# EAGLE design DMX RX (EAGLE 6.6.0)
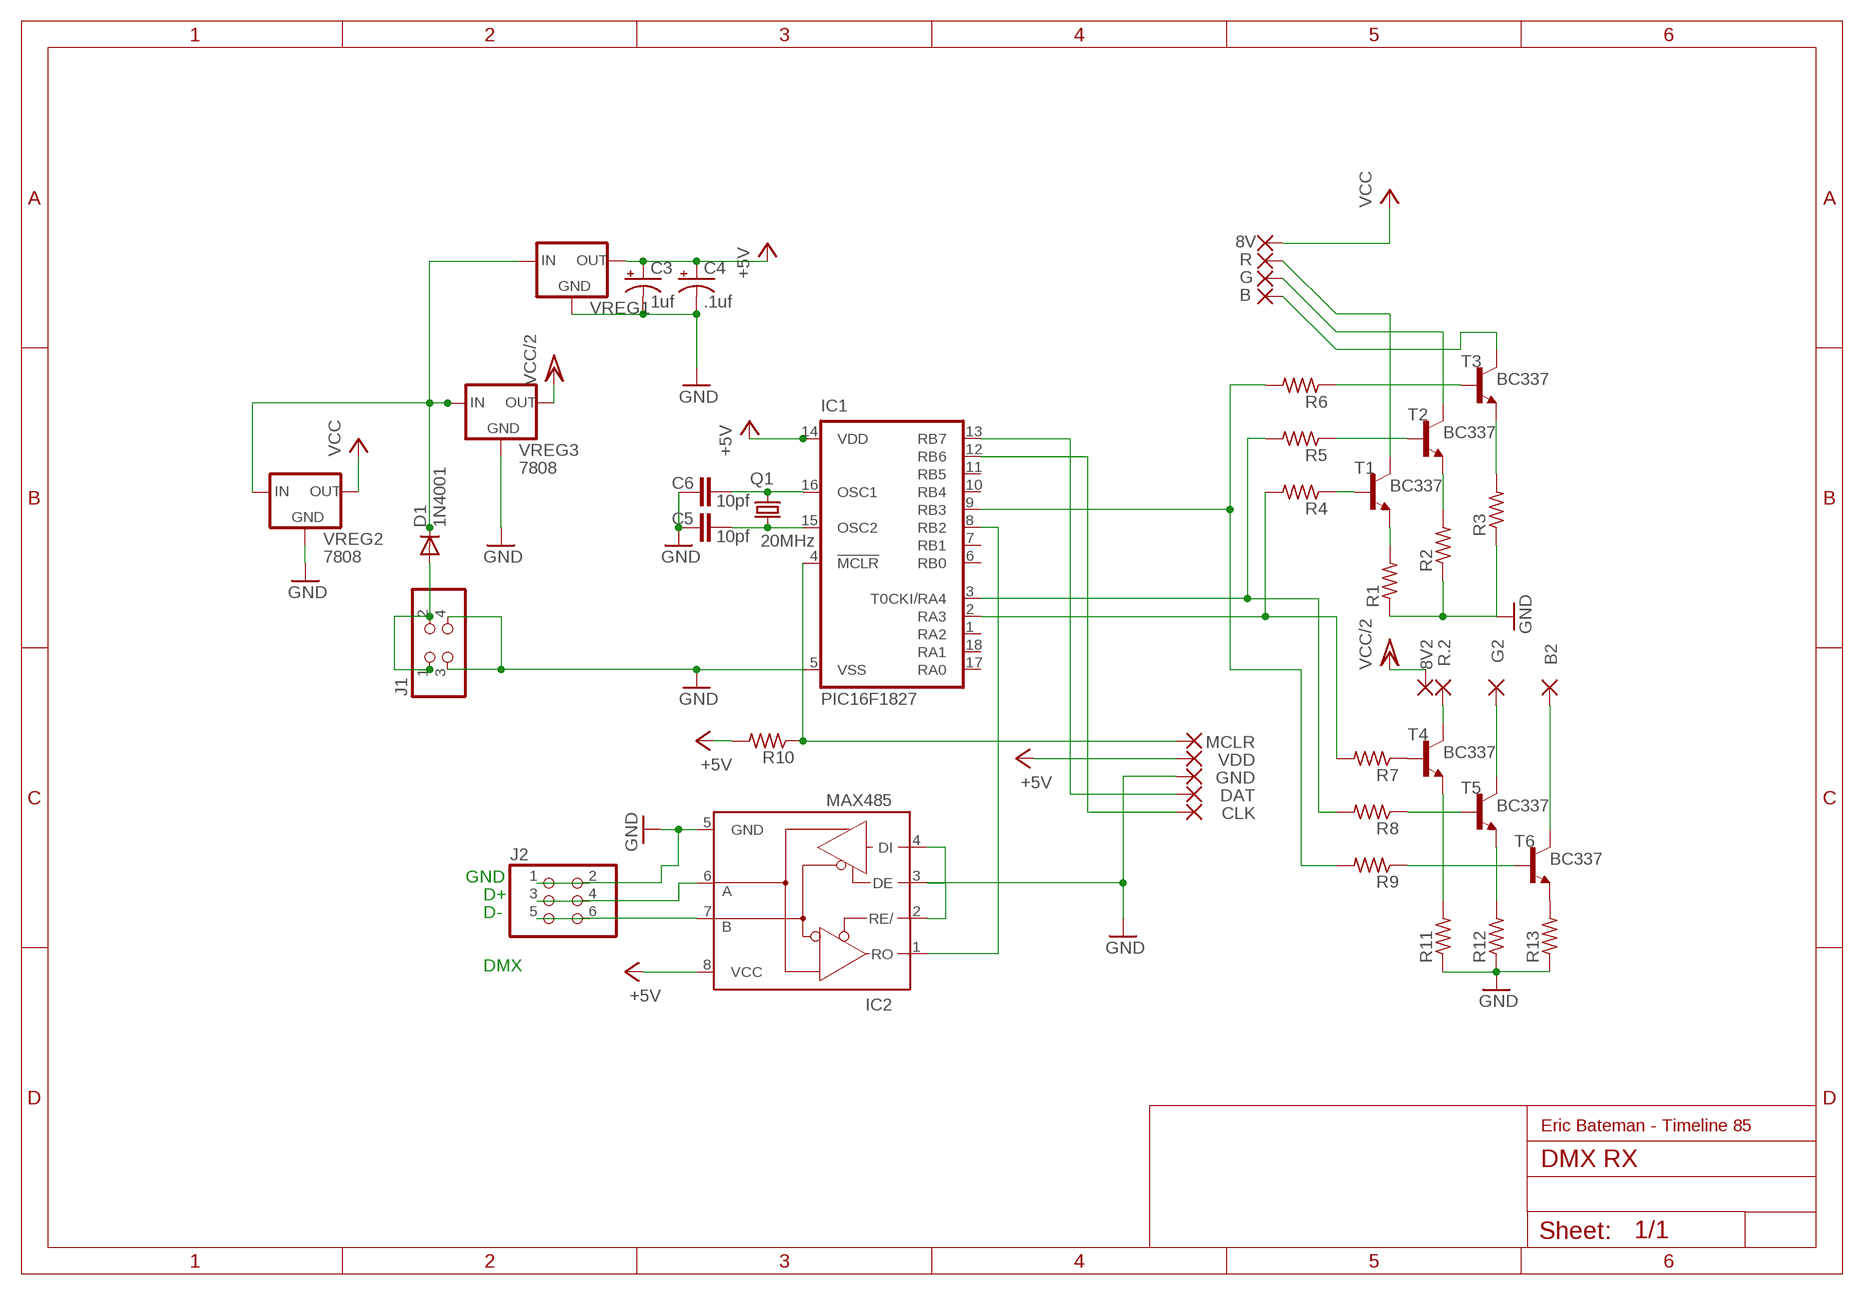
[diagram p0: schematic, sheet 1]

## Parts
8V  2,15/1,0  [2,15/1,0]
8V2  2,15/1,0  [2,15/1,0]
B  2,15/1,0  [2,15/1,0]
B2  2,15/1,0  [2,15/1,0]
C3  1uf  CPOL-USE2.5-7  [E2,5-7]
C4  .1uf  CPOL-USE2.5-7  [E2,5-7]
C5  10pf  C5/3.5  [C5B3.5]
C6  10pf  C5/3.5  [C5B3.5]
CLK  1,6/0,8  [1,6/0,8]
D1  1N4001  DIODEPTH  [DIODE-1N4001]
DAT  1,6/0,8  [1,6/0,8]
G  2,15/1,0  [2,15/1,0]
G2  2,15/1,0  [2,15/1,0]
GND  1,6/0,8  [1,6/0,8]
IC1  PIC16F1827  PIC16F83P  [DIL18]
IC2  MAX485  MAX3468CPA  [DIL08]
J1  PINHD-2X2/90  [2X02/90]
J2  PINHD-2X3/90  [2X03/90]
MCLR  1,6/0,8  [1,6/0,8]
Q1  20MHz  CRYSTALHC49S  [HC49/S]
R  2,15/1,0  [2,15/1,0]
R1  R-US_0411/12  [0411/12]
R2  R-US_0411/12  [0411/12]
R3  R-US_0411/12  [0411/12]
R4  R-US_0204/7  [0204/7]
R5  R-US_0204/7  [0204/7]
R6  R-US_0204/7  [0204/7]
R7  R-US_0204/7  [0204/7]
R8  R-US_0204/7  [0204/7]
R9  R-US_0204/7  [0204/7]
R10  R-US_0204/7  [0204/7]
R11  R-US_0411/12  [0411/12]
R12  R-US_0411/12  [0411/12]
R13  R-US_0411/12  [0411/12]
R.2  2,15/1,0  [2,15/1,0]
T1  BC337  [TO92]
T2  BC337  [TO92]
T3  BC337  [TO92]
T4  BC337  [TO92]
T5  BC337  [TO92]
T6  BC337  [TO92]
VDD  1,6/0,8  [1,6/0,8]
VREG1  78LXX  [78LXX]
VREG2  7808  78XXS  [78XXS]
VREG3  7808  78XXS  [78XXS]

## Nets
+5V: C3.+ C4.+ IC1.14(VDD) IC2.8(VCC) R10.2 VDD.1(P) VREG1.OUT
+12V: D1.C VREG1.IN VREG2.IN VREG3.IN
A: IC2.6(A) J2.3 J2.4
B: IC2.7(B) J2.5 J2.6
CLK: CLK.1(P) IC1.12(RB6)
DAT: DAT.1(P) IC1.13(RB7)
DC-IN: D1.A J1.1 J1.2
GND: C3.- C4.- C5.2 C6.2 GND.1(P) IC1.5(VSS) IC2.2(RE/) IC2.3(DE) IC2.4(DI) IC2.5(GND) J1.3 J1.4 J2.1 J2.2 R1.1 R2.1 R3.1 R11.1 R12.1 R13.1 VREG1.GND VREG2.GND VREG3.GND
MCLR: IC1.4(!MCLR) MCLR.1(P) R10.1
N$3: R6.1 T3.2(B)
N$4: R3.2 T3.1(E)
N$5: R1.2 T1.1(E)
N$6: C6.1 IC1.16(OSC1) Q1.1
N$7: C5.1 IC1.15(OSC2) Q1.2
N$8: IC1.2(RA3) R4.2 R7.2
N$10: IC1.3(T0CKI/RA4) R5.2 R8.2
N$11: IC1.9(RB3) R6.2 R9.2
N$12: R5.1 T2.2(B)
N$13: R4.1 T1.2(B)
N$14: R.1(P) T1.3(C)
N$15: G.1(P) T2.3(C)
N$16: R2.2 T2.1(E)
N$17: R7.1 T4.2(B)
N$18: R13.2 T6.1(E)
N$20: R12.2 T5.1(E)
N$21: R11.2 T4.1(E)
N$22: R9.1 T6.2(B)
N$23: R8.1 T5.2(B)
N$24: G2.1(P) T5.3(C)
N$25: B2.1(P) T6.3(C)
N$26: R.2.1(P) T4.3(C)
N$41: B.1(P) T3.3(C)
RX: IC1.8(RB2) IC2.1(RO)
VCC: 8V.1(P) VREG2.OUT
VCC/2: 8V2.1(P) VREG3.OUT
Unconnected: IC1.1(RA2) IC1.6(RB0) IC1.7(RB1) IC1.10(RB4) IC1.11(RB5) IC1.17(RA0) IC1.18(RA1)

## Notes on the sheet
- GND
- D+
- D-
- DMX
- Eric Bateman - Timeline 85

## Library data of the parts
8V 8V2 B B2 G G2 R R.2 = wirepad:2,15/1,0: THROUGH-HOLE PAD
C3 C4 = rcl:CPOL-US: POLARIZED CAPACITOR, American symbol
C5 C6 = capacitor-wima:C: CAPACITOR naming: grid - package width
CLK DAT GND MCLR VDD = wirepad:1,6/0,8: THROUGH-HOLE PAD
D1 = SparkFun:DIODE: Diode These are standard reverse protection diodes and small signal diodes. SMA package can handle up to about 1A. SOD-323 can handle about 200mA. What the SOD-323 package when ordering, there are some mfgs out there that are 5-pin packages.
IC1 = microchip:PIC16F8*: MICROCONTROLLER 8-Bit PIC16F8X Family - CMOS Flash/EEPROM Pin Compatible : PIC16F83, PIC16CR83, PIC16F84A, PIC16CR84 see also PIC16C* <DEVICE:PIC16C*>; MPN: PIC16F83-04/P; OC_FARNELL: 1084354; OC_NEWARK: 97K7388
IC2 = maxim:MAX34*: +5V, Fail-Safe, 40Mbps, Profibus RS-485/RS-422 Transceivers Source: MAX3465-MAX3469.pdf; OC_FARNELL: unknown; OC_NEWARK: unknown
J1 = pinhead:PINHD-2X2: PIN HEADER
J2 = pinhead:PINHD-2X3: PIN HEADER
Q1 = crystal:CRYSTAL: CRYSTAL; OC_FARNELL: 1667008; OC_NEWARK: unknown
R1-R13 = resistor:R-US_: RESISTOR, American symbol
T1-T6 = transistor-neu-to92:BC337: NPN TRANSISTOR
VREG1 = v-reg:78LXX: VOLTAGE REGULATOR
VREG2 VREG3 = v-reg:78XXS: VOLTAGE REGULATOR

## Board
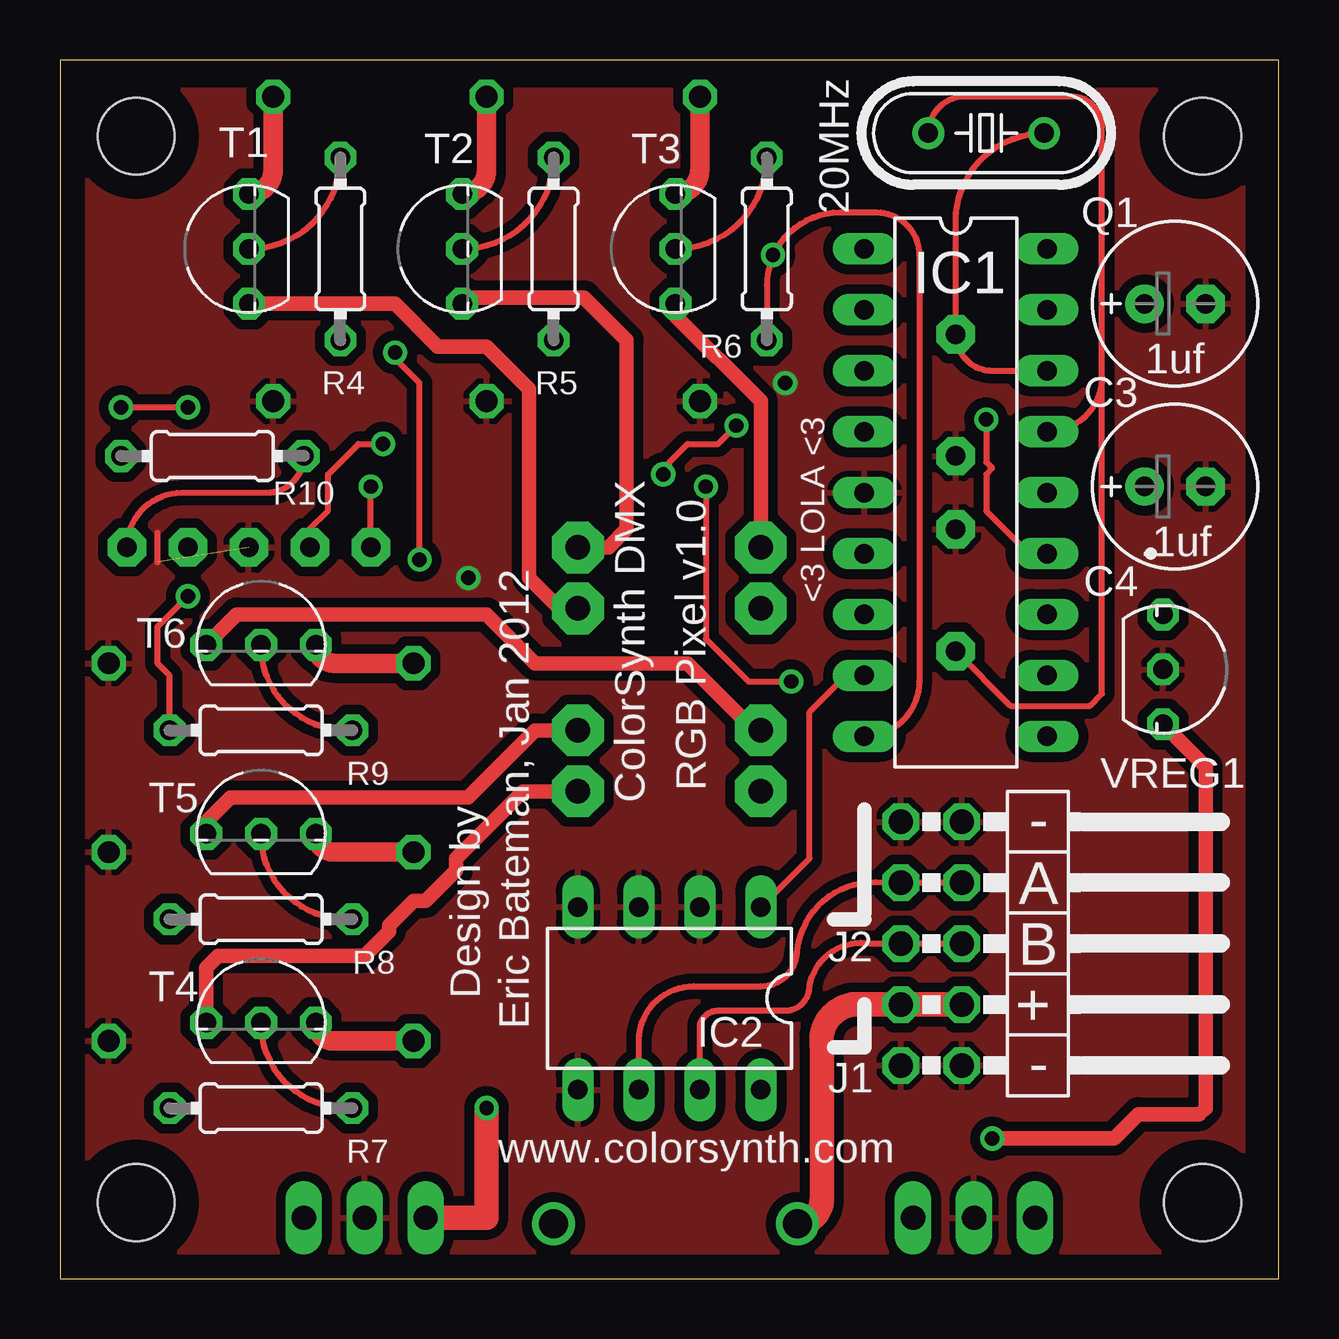
[diagram p1: board, top side]
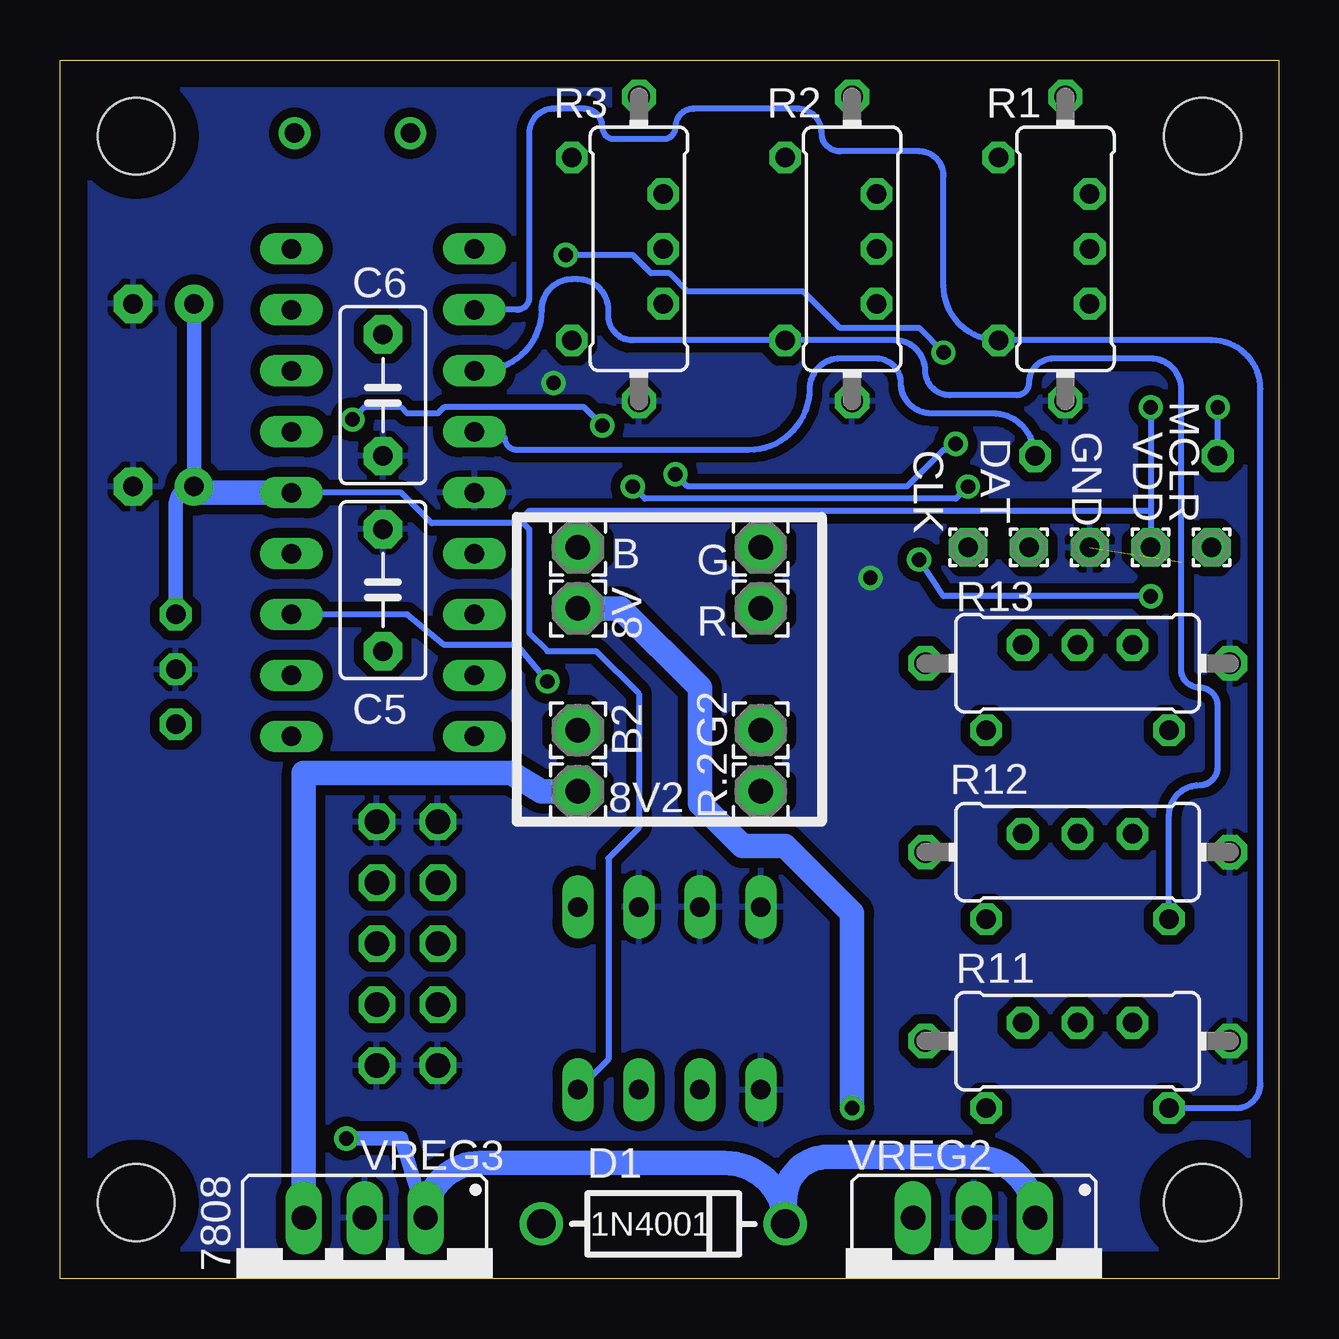
[diagram p2: board, bottom side, seen from below]

Size 50.8 x 50.8 mm. Coordinates in mm from the lower left corner, seen from the top.
Outline: 0,0 50.8,0 50.8,50.8 0,50.8 0,0
Copper layers (1*16): Top 0.035mm / dielectric 1.5mm / Bottom 0.035mm
Design rules "default": minimum track width 10mil, minimum drill 24mil, track to track 8mil, track to pad 8mil, pad to pad 8mil, via to via 8mil, smd to smd 8mil, copper to edge 40mil, drill to drill 8mil, minimum pad ring 10mil, minimum via ring 8mil, stop-mask expansion 4mil, vias tented up to drill 0mil, thermal gap 10mil
Holes 3.2 mm at 47.62,47.62 47.62,3.17 3.17,3.17 3.17,47.62

### Footprints (pad centres in the part's own frame; a part is rotated, then mirrored left to right if it is on the bottom)
2,15/1,0 = drill 1.016 pad 2.159 octagon: 1 0,0
E2,5-7 = drill 0.813 pad 1.6: + -1.27,0 | drill 0.813 pad 1.6 octagon: - 1.27,0
C5B3.5 = drill 0.813 pad 1.6 octagon: 1 -2.54,0; 2 2.54,0
1,6/0,8 = drill 0.813 pad 1.6 octagon: 1 0,0
DIODE-1N4001 = drill 1.2: A -5.08,0; C 5.08,0
DIL18 = drill 0.813 long: 1 -10.16,-3.81; 2 -7.62,-3.81; 3 -5.08,-3.81; 4 -2.54,-3.81; 5 0,-3.81; 6 2.54,-3.81; 7 5.08,-3.81; 8 7.62,-3.81; 9 10.16,-3.81; 10 10.16,3.81; 11 7.62,3.81; 12 5.08,3.81; 13 2.54,3.81; 14 0,3.81; 15 -2.54,3.81; 16 -5.08,3.81; 17 -7.62,3.81; 18 -10.16,3.81
DIL08 = drill 0.813 long: 1 -3.81,-3.81; 2 -1.27,-3.81; 3 1.27,-3.81; 4 3.81,-3.81; 5 3.81,3.81; 6 1.27,3.81; 7 -1.27,3.81; 8 -3.81,3.81
2X02/90 = drill 1.016 octagon: 1 -1.27,-6.35; 2 -1.27,-3.81; 3 1.27,-6.35; 4 1.27,-3.81
2X03/90 = drill 1.016 octagon: 1 -2.54,-6.35; 2 -2.54,-3.81; 3 0,-6.35; 4 0,-3.81; 5 2.54,-6.35; 6 2.54,-3.81
HC49/S = drill 0.813: 1 -2.413,0; 2 2.413,0
0411/12 = drill 0.914 octagon: 1 -6.35,0; 2 6.35,0
0204/7 = drill 0.813 octagon: 1 -3.81,0; 2 3.81,0
TO92 = drill 0.813 octagon: 1 2.286,0; 2 0,0; 3 -2.286,0
78LXX = drill 0.813 octagon: GND 0,0; IN 2.286,0; OUT -2.286,0
78XXS = drill 1.016 long: GND 0,-2.54; IN -2.54,-2.54; OUT 2.54,-2.54

### Placement (x,y rotation side)
8V  29.21,27.94 0 bottom
8V2  29.21,20.32 0 bottom
B  29.21,30.48 0 bottom
B2  29.21,22.86 0 bottom
C3  46.48,40.64 0 top
C4  46.48,33.02 0 top
C5  37.34,28.7 90 bottom
C6  37.34,36.83 270 bottom
CLK  12.95,30.48 270 bottom
D1  25.65,2.29 0 bottom
DAT  10.41,30.48 270 bottom
G  21.59,30.48 0 bottom
G2  21.59,22.86 0 bottom
GND  7.87,30.48 270 bottom
IC1  37.34,32.77 270 top
IC2  25.4,11.68 180 top
J1  41.4,10.16 270 top
J2  41.4,16.51 270 top
MCLR  2.79,30.48 270 bottom
Q1  38.61,47.75 180 top
R  21.59,27.94 0 bottom
R1  8.89,42.93 90 bottom
R2  17.78,42.93 90 bottom
R3  26.67,42.93 90 bottom
R4  11.68,42.93 270 top
R5  20.57,42.93 270 top
R6  29.46,42.93 270 top
R7  8.38,7.11 180 top
R8  8.38,14.99 180 top
R9  8.38,22.86 180 top
R10  6.35,34.29 180 top
R11  8.38,9.91 180 bottom
R12  8.38,17.78 180 bottom
R13  8.38,25.65 180 bottom
R.2  21.59,20.32 0 bottom
T1  7.87,42.93 90 top
T2  16.76,42.93 90 top
T3  25.65,42.93 90 top
T4  8.38,10.67 0 top
T5  8.38,18.54 0 top
T6  8.38,26.42 0 top
VDD  5.33,30.48 270 bottom
VREG1  45.97,25.4 270 top
VREG2  12.7,0 180 bottom
VREG3  38.1,0 180 bottom

### Tracks (layer width: path | path; a pad name or v marks a point on that pad's centre or on a via)
+5V  (via drill 0.6)
  Top 0.254: v2.54,36.32 v5.33,36.32
  Bottom 0.254: R10.2 v2.54,36.32 | v5.33,36.32 5.33,32 | 5.33,32 VDD.1 | 5.33,32 31.24,32 31.75,31.5 | 31.75,31.5 35.31,31.5 36.58,32.77 IC1.14 | IC2.8 27.94,9.14 27.94,17.53 26.67,18.8 26.67,24.38 28.45,26.16 30.48,26.16 31.24,26.92 31.24,31.24 31.5,31.5 31.75,31.5
  Bottom 0.61: VREG1.OUT 45.97,32.26 arc90 C4.+ C3.+
  Bottom 1.016: IC1.14 44.96,32.77 arc90 C4.+
+12V  (via drill 0.6)
  Top 0.61: VREG1.IN 47.75,21.34 47.75,7.11 47.5,6.86 44.96,6.86 43.94,5.84 v38.86,5.84
  Bottom 0.61: v38.86,5.84 36.58,5.84 VREG3.IN
  Bottom 1.016: VREG3.IN arc90 33.27,4.83 23.11,4.83 arc90 D1.C 20.57,3.3 arc90 18.8,5.08 12.7,5.08 arc90 VREG2.IN
A
  Top 0.254: J2.4 J2.3 34.29,16.51 arc90 30.73,13.72 arc-90 29.21,12.19 26.42,12.19 arc90 24.13,9.91 IC2.6
B
  Top 0.254: J2.6 J2.5 33.78,13.97 arc90 31.24,12.19 arc-90 30.23,11.18 27.43,11.18 arc90 26.67,10.41 IC2.7
CLK  (via drill 0.6)
  Top 0.254: CLK.1 v12.95,33.02 | v26.92,33.02 26.92,26.67 28.7,24.89 v30.48,24.89
  Bottom 0.254: v12.95,33.02 13.46,32.51 26.42,32.51 v26.92,33.02 | v30.48,24.89 31.75,26.42 34.8,26.42 36.32,27.69 IC1.12
DAT  (via drill 0.6)
  Top 0.254: DAT.1 10.41,31.24 11.18,32 11.18,33.53 12.45,34.8 v13.46,34.8 | v25.15,33.53 25.4,33.78 25.4,34.04 26.16,34.8 27.43,34.8 v28.19,35.56 | v38.61,35.81 38.61,34.04 38.86,33.78 38.61,33.53 38.61,32 40.13,30.48 41.15,30.48 IC1.13
  Bottom 0.254: v13.46,34.8 13.72,34.54 13.97,34.54 15.49,33.02 24.64,33.02 v25.15,33.53 | v28.19,35.56 28.96,36.32 34.8,36.32 35.05,36.07 36.32,36.07 36.58,36.32 38.1,36.32 v38.61,35.81
DC-IN
  Top 0.254: J1.1 35.56,11.43
  Top 1.016: J1.2 J1.1 33.02,11.43 arc90 31.75,9.65 31.75,3.3 arc-90 D1.A
GND  (via drill 0.6)  (1 unrouted)
  Top 0.254: 4.06,29.86 4.06,31.1
  other vias: 17.02,29.21 30.23,37.34
  pour Bottom (isolate 0.406): 1.27,49.53 49.53,49.53 49.53,1.27 1.27,1.27
  pour Top (isolate 0.406): 1.02,49.53 49.28,49.53 49.28,1.02 1.02,1.02
MCLR
  Top 0.254: MCLR.1 arc-90 5.08,32.77 8.64,32.77 arc90 R10.1
  Bottom 0.254: R10.1 arc-90 11.94,36.07 14.48,36.07 arc90 15.75,37.34 arc-90 16.76,38.35 18.29,38.35 arc-90 19.56,37.08 arc90 22.1,34.54 31.75,34.54 arc90 32.26,35.05 33.27,35.05 arc90 IC1.4
N$3
  Top 0.254: T3.2 arc90 R6.1
N$4
  Top 0.813: R3.2 26.67,46.23 arc-90 T3.1
N$5
  Top 0.813: R1.2 8.89,46.23 arc-90 T1.1
N$6
  Top 0.254: IC1.16 38.86,37.85 arc-90 C6.1 37.34,44.07 arc-90 Q1.1
N$7
  Top 0.254: 43.43,37.59 43.43,48.01 arc90 42.16,49.28 37.72,49.28 arc90 Q1.2 | 43.43,37.59 arc-90 IC1.15 | C5.1 39.62,23.88 42.93,23.88 43.43,24.38 43.43,37.59
N$8
  Bottom 0.254: IC1.2 31.75,40.39 arc-90 31.24,40.89 31.24,47.75 arc90 30.23,48.77 28.96,48.77 arc90 28.19,48.01 arc-90 27.69,47.5 25.65,47.5 arc-90 25.15,48.01 arc90 24.38,48.77 20.07,48.77 arc90 19.05,47.75 arc-90 18.29,46.99 14.99,46.99 arc90 13.97,45.97 13.97,41.4 arc-90 R4.2 2.79,39.12 arc90 0.76,37.08 0.76,8.13 arc90 1.78,7.11 R7.2
N$10
  Bottom 0.254: IC1.3 33.27,37.85 arc-90 30.73,40.39 arc90 29.46,41.66 29.21,41.66 arc90 27.94,40.39 27.94,40.13 arc-90 26.92,39.12 R5.2 16,39.12 arc90 14.73,37.85 arc-90 13.72,36.83 10.92,36.83 arc-90 10.41,37.34 arc90 9.4,38.35 5.33,38.35 arc90 4.06,37.08 4.06,25.4 arc-90 3.3,24.64 arc90 2.54,23.88 2.54,21.34 arc90 3.3,20.57 arc-90 4.57,19.3 R8.2
N$11  (via drill 0.6)
  Top 0.254: R6.2 29.46,41.4 arc-24 29.74,42.66 | 29.74,42.66 arc-66 32.51,44.45 34.04,44.45 arc-90 35.81,42.67 35.81,24.89 arc-90 IC1.9 | R9.2 4.57,25.15 4.06,25.65 4.06,27.18 v5.33,28.45 | v14.99,29.97 14.99,37.34 13.97,38.35 v13.97,38.61 | v29.72,42.67 29.74,42.66
  Bottom 0.254: v5.33,28.45 13.97,28.45 v14.99,29.97 | v13.97,38.61 14.99,39.62 18.29,39.62 19.81,41.15 24.64,41.15 25.4,41.91 26.16,41.91 26.92,42.67 v29.72,42.67
N$12
  Top 0.254: T2.2 arc90 R5.1
N$13
  Top 0.254: T1.2 arc90 R4.1
N$14
  Top 0.61: T1.3 13.97,40.64 15.75,38.86 17.78,38.86 19.56,37.08 19.56,29.21 20.83,27.94 R.1
N$15
  Top 0.61: T2.3 17.02,40.89 21.84,40.89 23.62,39.12 23.62,31.24 22.86,30.48 G.1
N$16
  Top 0.813: R2.2 17.78,46.23 arc-90 T2.1
N$17
  Top 0.254: R7.1 11.94,7.11 arc-90 T4.2
N$18
  Top 0.813: R13.2 11.43,25.65 arc-90 T6.1
N$20
  Top 0.813: R12.2 11.43,17.78 arc-90 T5.1
N$21
  Top 0.813: R11.2 11.43,9.91 arc-90 T4.1
N$22
  Top 0.254: R9.1 11.94,22.86 arc-90 T6.2
N$23
  Top 0.254: R8.1 11.94,14.99 arc-90 T5.2
N$24
  Top 0.61: G2.1 19.81,22.86 17.02,20.07 7.11,20.07 6.1,19.05 T5.3
N$25
  Top 0.61: T6.3 7.37,27.69 17.78,27.69 19.81,25.65 26.16,25.65 28.96,22.86 B2.1
N$26
  Top 0.61: R.2.1 19.3,20.32 16.51,17.53 16.51,17.02 15.24,15.75 14.73,15.75 13.72,14.73 13.72,14.48 12.7,13.46 6.6,13.46 6.1,12.95 T4.3
N$41
  Top 0.61: T3.3 25.65,40.13 29.21,36.58 B.1
RX
  Top 0.254: IC2.1 31.24,17.53 31.24,23.62 32.77,25.15 IC1.8
VCC  (via drill 0.6)
  Top 1.016: VREG2.OUT 17.78,2.54 v17.78,7.11
  Bottom 1.016: v17.78,7.11 17.78,15.24 20.57,18.03 22.35,18.03 24.13,19.81 24.13,24.64 27.43,27.94 8V.1
VCC/2
  Bottom 1.016: VREG3.OUT 40.64,21.08 32,21.08 30.73,20.32 8V2.1

### Text on the board
tSS: ColorSynth DMX | RGB Pixel v1.0 | <3 LOLA <3 | - | A | B | Design by | + | Eric Bateman, Jan 2012 | - | www.colorsynth.com